# Altium schematic sheet BV100011_ControlTopLevel.SchDoc
size A3
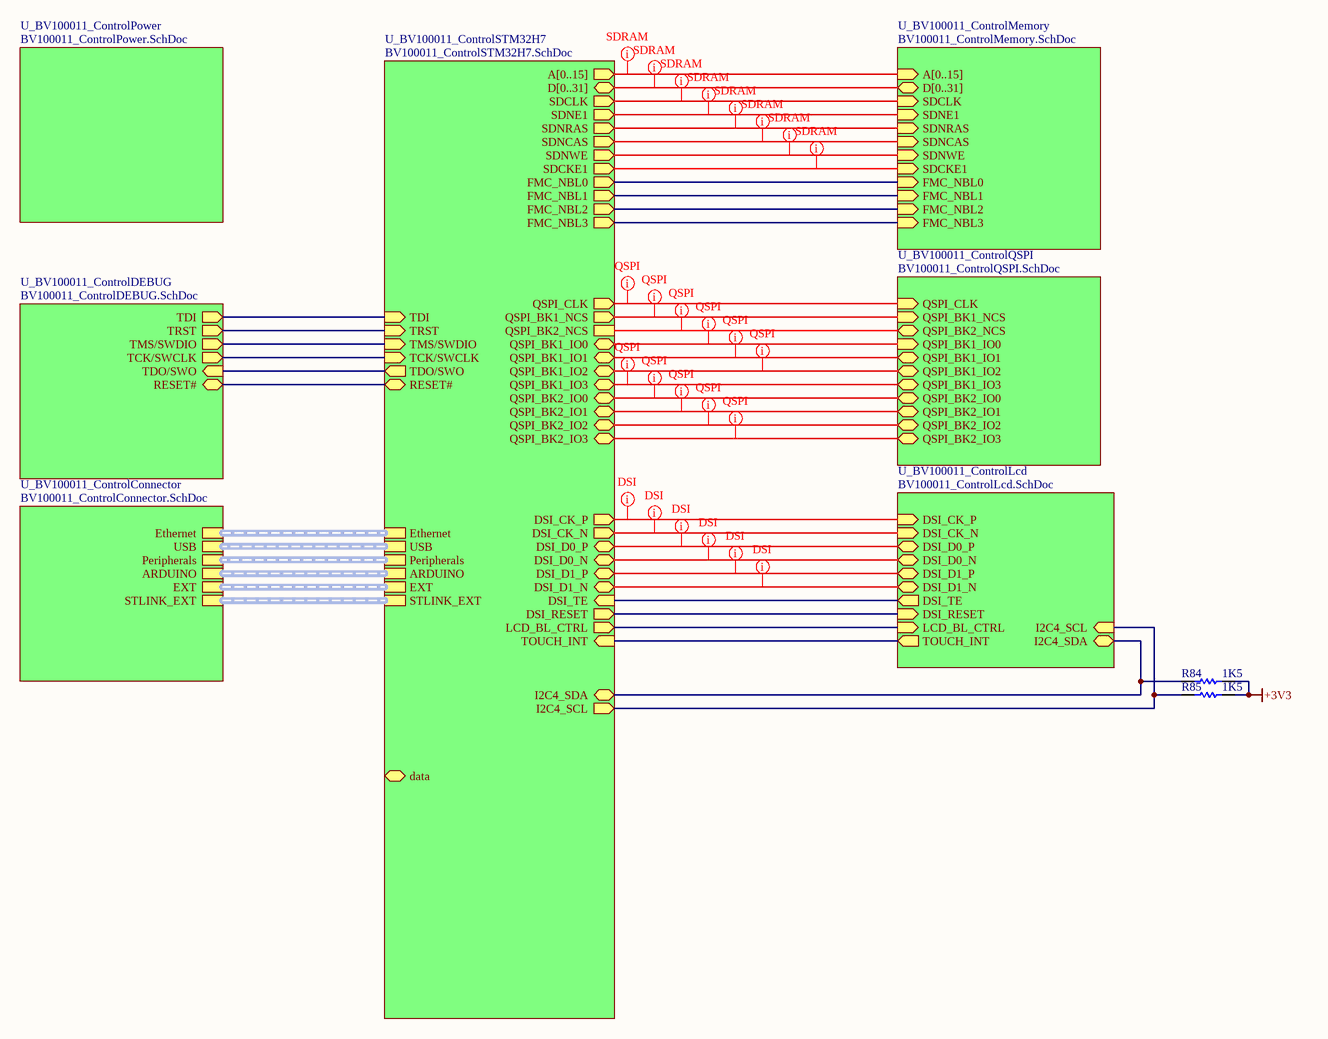
[diagram p0: BV100011_ControlTopLevel.SchDoc]

## Parts
R84  1K5  [R0603]
R85  1K5  [R0603]

## Sub-sheets
U_BV100011_ControlConnector = BV100011_ControlConnector.SchDoc: Ethernet (harness Ethernet), USB (harness USB), Peripherals (harness Peripherals), ARDUINO (harness ARDUINO), EXT (harness EXT), STLINK_EXT (harness STLINK_EXT)
U_BV100011_ControlDEBUG = BV100011_ControlDEBUG.SchDoc: TDI (out), RESET# (bidir), TRST (out), TMS/SWDIO (out), TCK/SWCLK (out), TDO/SWO (in)
U_BV100011_ControlLcd = BV100011_ControlLcd.SchDoc: DSI_CK_P (in), DSI_CK_N (in), DSI_D0_P (bidir), DSI_D0_N (bidir), DSI_D1_P (bidir), DSI_D1_N (bidir), LCD_BL_CTRL (in), DSI_TE (out), I2C4_SDA (bidir), I2C4_SCL (in), TOUCH_INT (out), DSI_RESET (in)
U_BV100011_ControlMemory = BV100011_ControlMemory.SchDoc: FMC_NBL0 (in), FMC_NBL1 (in), D[0..31] (bidir), A[0..15] (in), SDNCAS (in), SDNWE (in), SDNRAS (in), SDNE1 (in), SDCKE1 (in), SDCLK (in), FMC_NBL3 (in), FMC_NBL2 (in)
U_BV100011_ControlPower = BV100011_ControlPower.SchDoc: no entries
U_BV100011_ControlQSPI = BV100011_ControlQSPI.SchDoc: QSPI_BK1_IO3 (bidir), QSPI_BK1_IO1 (bidir), QSPI_BK1_NCS (in), QSPI_BK1_IO0 (in), QSPI_BK1_IO2 (bidir), QSPI_CLK (in), QSPI_BK2_IO0 (bidir), QSPI_BK2_IO1 (bidir), QSPI_BK2_IO2 (bidir), QSPI_BK2_IO3 (bidir), QSPI_BK2_NCS (bidir)
U_BV100011_ControlSTM32H7 = BV100011_ControlSTM32H7.SchDoc: TMS/SWDIO (in), TCK/SWCLK (in), TDI (in), TDO/SWO (out), TRST (in), QSPI_CLK (out), QSPI_BK1_IO0 (bidir), FMC_NBL0 (out), FMC_NBL1 (out), SDNRAS (out), QSPI_BK1_IO3 (bidir), QSPI_BK1_IO2 (bidir), QSPI_BK1_IO1 (bidir), SDCLK (out), SDNCAS (out), QSPI_BK1_NCS (out), QSPI_BK2_IO2 (bidir), QSPI_BK2_IO3 (bidir), SDCKE1 (out), SDNE1 (out), SDNWE (out), QSPI_BK2_IO0 (bidir), QSPI_BK2_IO1 (bidir), FMC_NBL3 (out), FMC_NBL2 (out), D[0..31] (bidir), A[0..15] (out), DSI_CK_P (out), DSI_CK_N (out), DSI_D0_P (bidir), DSI_D0_N (bidir), DSI_D1_P (bidir), DSI_D1_N (bidir), LCD_BL_CTRL (out), I2C4_SCL (out), I2C4_SDA (bidir), TOUCH_INT (in), DSI_RESET (out), DSI_TE (in), RESET# (bidir), Ethernet (harness Ethernet), USB (harness USB), Peripherals (harness Peripherals), ARDUINO (harness ARDUINO), EXT (harness EXT), STLINK_EXT (harness STLINK_EXT), QSPI_BK2_NCS, data (bidir)

## Nets
+3V3: R84.1 R85.1
NetR84_2: R84.2 ; sheet U_BV100011_ControlSTM32H7/I2C4_SDA, sheet U_BV100011_ControlLcd/I2C4_SDA
NetR85_2: R85.2 ; sheet U_BV100011_ControlSTM32H7/I2C4_SCL, sheet U_BV100011_ControlLcd/I2C4_SCL
(unnamed): sheet U_BV100011_ControlSTM32H7/TMS/SWDIO, sheet U_BV100011_ControlDEBUG/TMS/SWDIO
(unnamed): sheet U_BV100011_ControlSTM32H7/TCK/SWCLK, sheet U_BV100011_ControlDEBUG/TCK/SWCLK
(unnamed): sheet U_BV100011_ControlSTM32H7/TDI, sheet U_BV100011_ControlDEBUG/TDI
(unnamed): sheet U_BV100011_ControlSTM32H7/TDO/SWO, sheet U_BV100011_ControlDEBUG/TDO/SWO
(unnamed): sheet U_BV100011_ControlSTM32H7/TRST, sheet U_BV100011_ControlDEBUG/TRST
(unnamed): sheet U_BV100011_ControlSTM32H7/QSPI_CLK, sheet U_BV100011_ControlQSPI/QSPI_CLK
(unnamed): sheet U_BV100011_ControlSTM32H7/QSPI_BK1_IO0, sheet U_BV100011_ControlQSPI/QSPI_BK1_IO0
(unnamed): sheet U_BV100011_ControlSTM32H7/FMC_NBL0, sheet U_BV100011_ControlMemory/FMC_NBL0
(unnamed): sheet U_BV100011_ControlSTM32H7/FMC_NBL1, sheet U_BV100011_ControlMemory/FMC_NBL1
(unnamed): sheet U_BV100011_ControlSTM32H7/SDNRAS, sheet U_BV100011_ControlMemory/SDNRAS
(unnamed): sheet U_BV100011_ControlSTM32H7/QSPI_BK1_IO3, sheet U_BV100011_ControlQSPI/QSPI_BK1_IO3
(unnamed): sheet U_BV100011_ControlSTM32H7/QSPI_BK1_IO2, sheet U_BV100011_ControlQSPI/QSPI_BK1_IO2
(unnamed): sheet U_BV100011_ControlSTM32H7/QSPI_BK1_IO1, sheet U_BV100011_ControlQSPI/QSPI_BK1_IO1
(unnamed): sheet U_BV100011_ControlSTM32H7/SDCLK, sheet U_BV100011_ControlMemory/SDCLK
(unnamed): sheet U_BV100011_ControlSTM32H7/SDNCAS, sheet U_BV100011_ControlMemory/SDNCAS
(unnamed): sheet U_BV100011_ControlSTM32H7/QSPI_BK1_NCS, sheet U_BV100011_ControlQSPI/QSPI_BK1_NCS
(unnamed): sheet U_BV100011_ControlSTM32H7/QSPI_BK2_IO2, sheet U_BV100011_ControlQSPI/QSPI_BK2_IO2
(unnamed): sheet U_BV100011_ControlSTM32H7/QSPI_BK2_IO3, sheet U_BV100011_ControlQSPI/QSPI_BK2_IO3
(unnamed): sheet U_BV100011_ControlSTM32H7/SDCKE1, sheet U_BV100011_ControlMemory/SDCKE1
(unnamed): sheet U_BV100011_ControlSTM32H7/SDNE1, sheet U_BV100011_ControlMemory/SDNE1
(unnamed): sheet U_BV100011_ControlSTM32H7/SDNWE, sheet U_BV100011_ControlMemory/SDNWE
(unnamed): sheet U_BV100011_ControlSTM32H7/QSPI_BK2_IO0, sheet U_BV100011_ControlQSPI/QSPI_BK2_IO0
(unnamed): sheet U_BV100011_ControlSTM32H7/QSPI_BK2_IO1, sheet U_BV100011_ControlQSPI/QSPI_BK2_IO1
(unnamed): sheet U_BV100011_ControlSTM32H7/FMC_NBL3, sheet U_BV100011_ControlMemory/FMC_NBL3
(unnamed): sheet U_BV100011_ControlSTM32H7/FMC_NBL2, sheet U_BV100011_ControlMemory/FMC_NBL2
(unnamed): sheet U_BV100011_ControlSTM32H7/DSI_CK_P, sheet U_BV100011_ControlLcd/DSI_CK_P
(unnamed): sheet U_BV100011_ControlSTM32H7/DSI_CK_N, sheet U_BV100011_ControlLcd/DSI_CK_N
(unnamed): sheet U_BV100011_ControlSTM32H7/DSI_D0_P, sheet U_BV100011_ControlLcd/DSI_D0_P
(unnamed): sheet U_BV100011_ControlSTM32H7/DSI_D0_N, sheet U_BV100011_ControlLcd/DSI_D0_N
(unnamed): sheet U_BV100011_ControlSTM32H7/DSI_D1_P, sheet U_BV100011_ControlLcd/DSI_D1_P
(unnamed): sheet U_BV100011_ControlSTM32H7/DSI_D1_N, sheet U_BV100011_ControlLcd/DSI_D1_N
(unnamed): sheet U_BV100011_ControlSTM32H7/LCD_BL_CTRL, sheet U_BV100011_ControlLcd/LCD_BL_CTRL
(unnamed): sheet U_BV100011_ControlSTM32H7/TOUCH_INT, sheet U_BV100011_ControlLcd/TOUCH_INT
(unnamed): sheet U_BV100011_ControlSTM32H7/DSI_RESET, sheet U_BV100011_ControlLcd/DSI_RESET
(unnamed): sheet U_BV100011_ControlSTM32H7/DSI_TE, sheet U_BV100011_ControlLcd/DSI_TE
(unnamed): sheet U_BV100011_ControlSTM32H7/RESET#, sheet U_BV100011_ControlDEBUG/RESET#
(unnamed): sheet U_BV100011_ControlSTM32H7/QSPI_BK2_NCS, sheet U_BV100011_ControlQSPI/QSPI_BK2_NCS

## Buses and harness runs
bus sheet U_BV100011_ControlMemory/A[0..15] = sheet U_BV100011_ControlSTM32H7/A[0..15]
bus sheet U_BV100011_ControlMemory/D[0..31] = sheet U_BV100011_ControlSTM32H7/D[0..31]
harness sheet U_BV100011_ControlConnector/ARDUINO = sheet U_BV100011_ControlSTM32H7/ARDUINO
harness sheet U_BV100011_ControlConnector/Ethernet = sheet U_BV100011_ControlSTM32H7/Ethernet
harness sheet U_BV100011_ControlConnector/EXT = sheet U_BV100011_ControlSTM32H7/EXT
harness sheet U_BV100011_ControlConnector/Peripherals = sheet U_BV100011_ControlSTM32H7/Peripherals
harness sheet U_BV100011_ControlConnector/STLINK_EXT = sheet U_BV100011_ControlSTM32H7/STLINK_EXT
harness sheet U_BV100011_ControlConnector/USB = sheet U_BV100011_ControlSTM32H7/USB

## Layout directives
rule Matched Net Lengths [Tolerance = 100mil]; net class SDRAM: (no net found under the mark)
rule Matched Net Lengths [Tolerance = 100mil]; net class QSPI: (no net found under the mark)
rule Matched Net Lengths [Tolerance = 100mil]; net class DSI: (no net found under the mark)

## Library data of the parts
R84 R85 = Res1: Resistor; Value: 1K; Published: 8-Jun-2000; Revision: July-2002: Re-released for DXP Platform.; Publisher: Altium Limited